# EAGLE design BatteryMQTTSense (EAGLE 9.2.2)
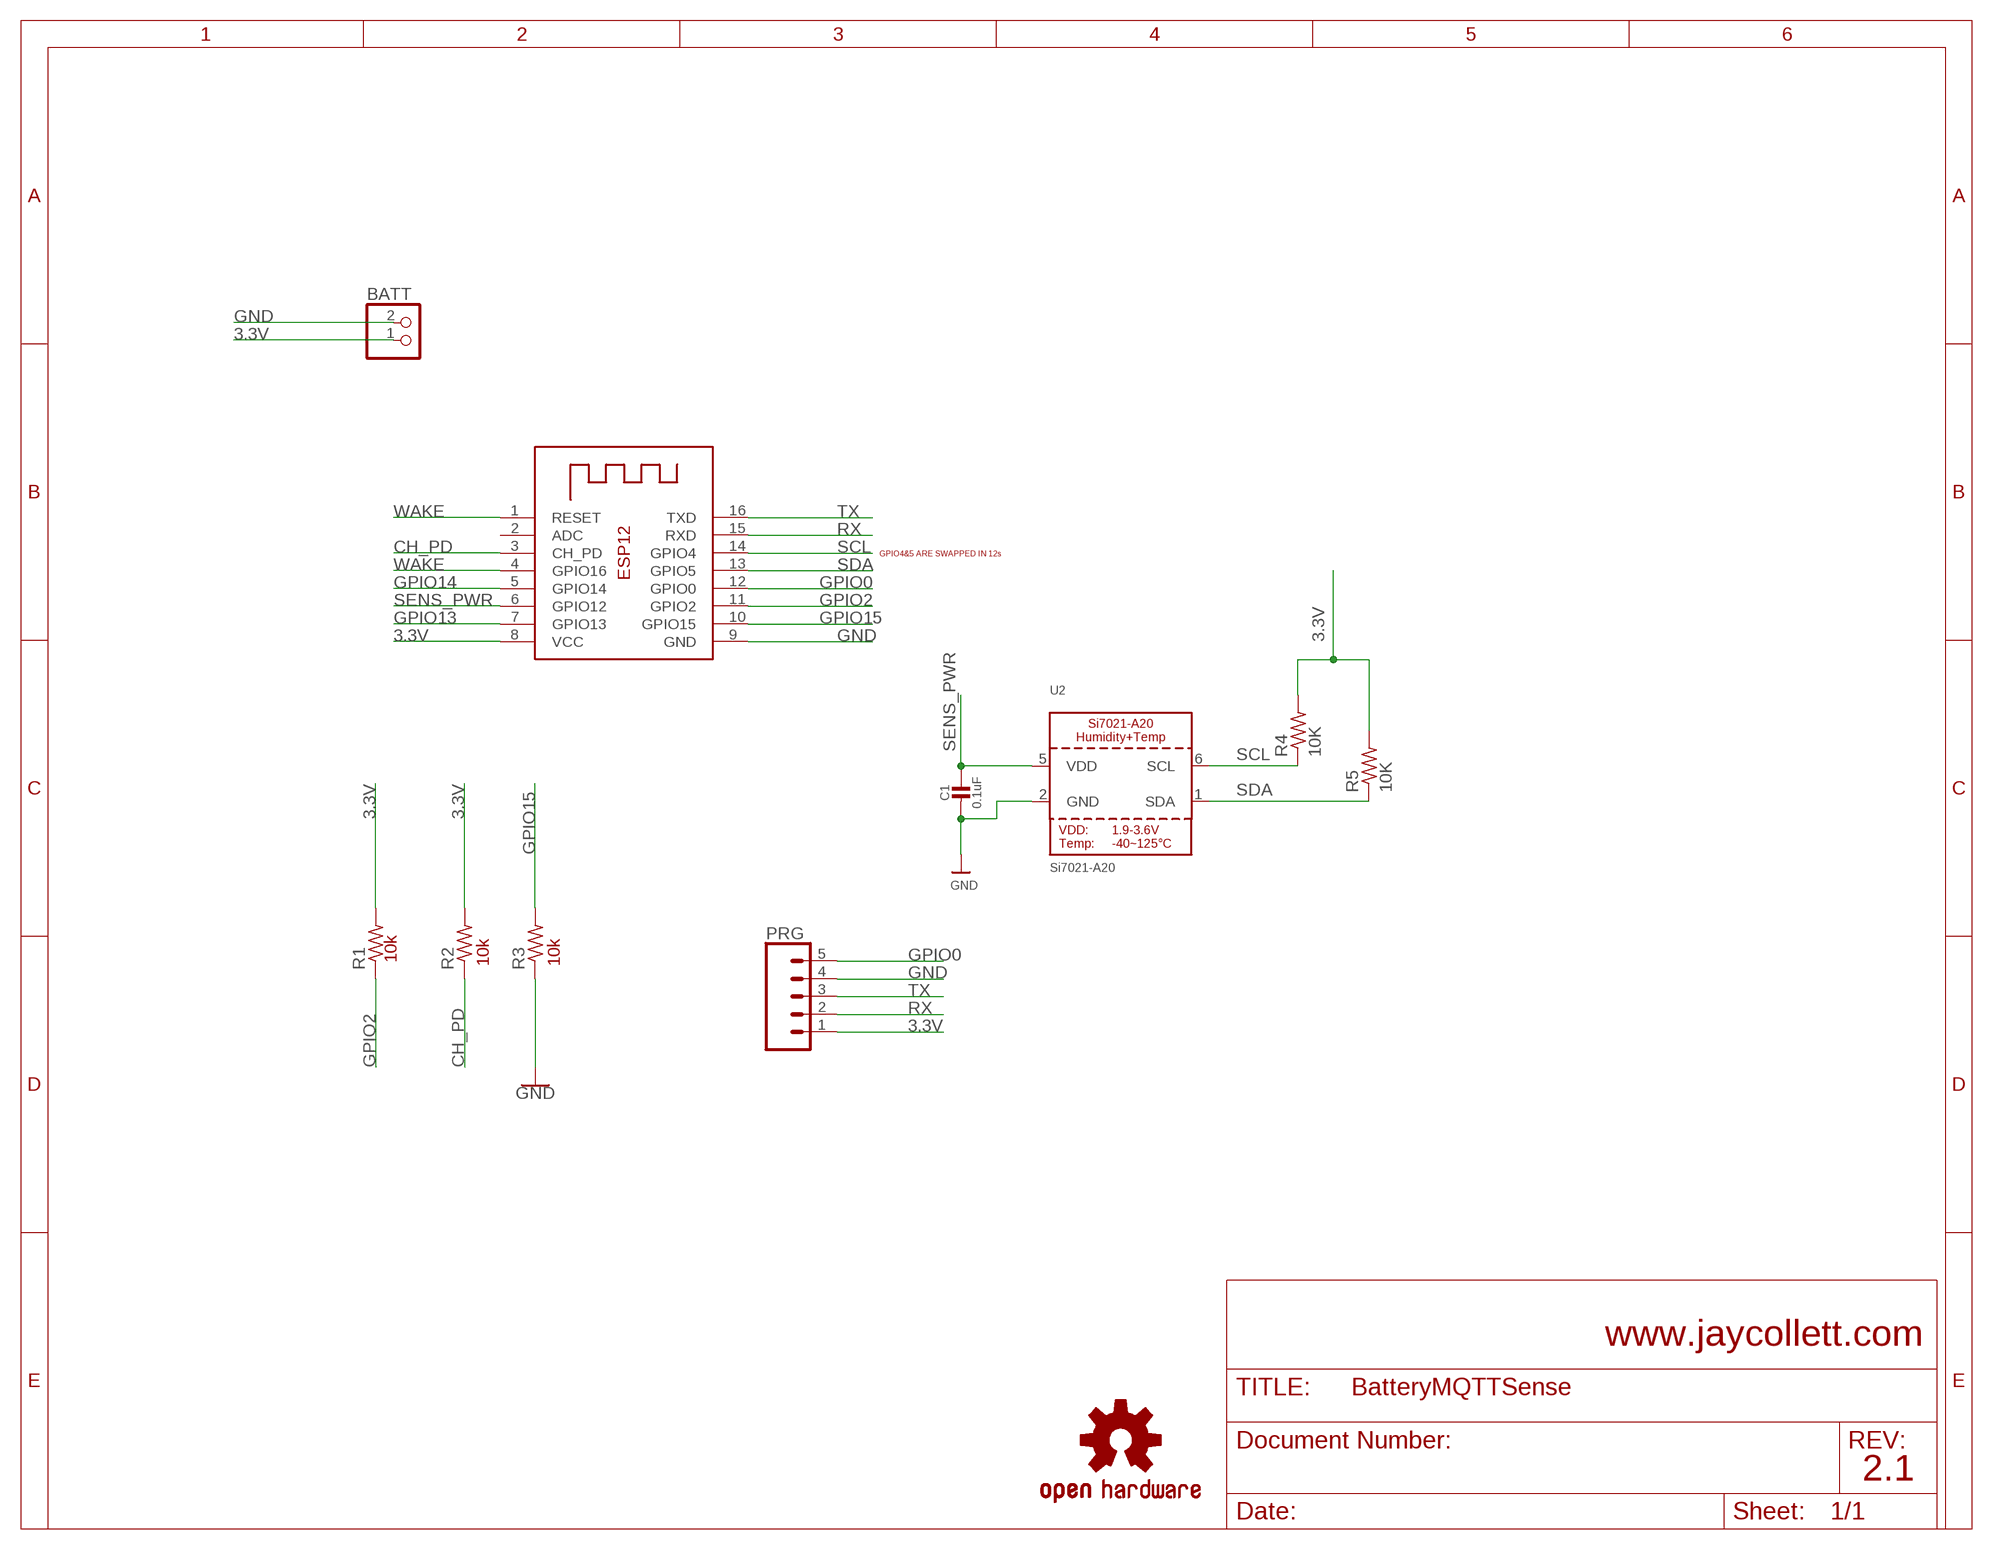
[diagram p0: schematic, sheet 1]

## Parts
_  ESP-12  [ESP-12]
BATT  JST_2PIN-THM-RA  [JST-PH-2-THM-RA]
C1  0.1uF  CAP_CERAMIC0805-NOOUTLINE  [0805-NO]
LOGO1  OSHW-LOGOS  [OSHW-LOGO-S]
PRG  CONN_05PTH_LONGPADS  [1X05_LONGPADS]
R1  R-US_M0805  [M0805]
R2  R-US_M0805  [M0805]
R3  R-US_M0805  [M0805]
R4  10K  R-US_M0805  [M0805]
R5  10K  R-US_M0805  [M0805]
U2  Si7021-A20  SI7021-A20  [DFN6_3X3_SI]

## Nets
3.3V [3.3V]: _.8(VCC) BATT.1 PRG.1 R1.2 R2.2 R4.2 R5.2
CH_PD: _.3(CH_PD) R2.1
GND: _.9(GND) BATT.2 C1.2 PRG.4 R3.1 U2.2(GND)
GPIO0: _.12(GPIO0) PRG.5
GPIO2: _.11(GPIO2) R1.1
GPIO13: _.7(GPIO13)
GPIO14: _.5(GPIO14)
GPIO15: _.10(GPIO15) R3.2
RX: _.15(RXD) PRG.2
SCL: _.14(GPIO4) R4.1 U2.6(SCL)
SDA: _.13(GPIO5) R5.1 U2.1(SDA)
SENS_PWR: _.6(GPIO12) C1.1 U2.5(VDD)
TX: _.16(TXD) PRG.3
WAKE: _.1(RESET) _.4(GPIO16)
Unconnected: _.2(ADC)

## Notes on the sheet
- GPIO4&5 ARE SWAPPED IN 12s
- 10k | 10k | 10k
- www.jaycollett.com
- 2.1

## Library data of the parts
_ = adafruit:ESP-12
BATT = adafruit:JST_2PIN: JST 2-Pin Connectors of various flavors SMT-RA (S2B-PH-SM4) 4UConnector #17311 SMT (B2B-PH-SM4) THM-RA (S2B-PH) THM (B2B-PH)
C1 = microbuilder:CAP_CERAMIC: Ceramic Capacitors For new designs, use the packages preceded by an '_' character since they are more reliable: The following footprints should be used on most boards: _0402 - Standard footprint for regular board layouts _0603 - Standard footprint for regular board layouts _0805 - Standard footprint for regular board layouts _1206 - Standard footprint for regular board layouts For extremely tight-pitch boards where space is at a premium, the following 'micro-pitch' footprints can be used (smaller pads, no silkscreen outline, etc.): _0402MP - Micro-pitch footprint for very dense/compact boards _0603MP - Micro-pitch footprint for very dense/compact boards _0805MP - Micro-pitch footprint for very dense/compact boards _1206MP - Micro-pitch footprint for very dense/compact boards
LOGO1 = SparkFun-Aesthetics:OSHW-LOGO: Open-Source Hardware (OSHW) Logo This logo indicates the piece of hardware it is found on incorporates a OSHW license and/or adheres to the definition of open source hardware found here: http://freedomdefined.org/OSHW
PRG = SparkFun-Connectors:CONN_05: Multi connection point. Often used as Generic Header-pin footprint for 0.1 inch spaced/style header connections On any of the 0.1 inch spaced packages, you can populate with these: Break Away Headers - Straight <https://www.sparkfun.com/products/116> (PRT-00116) Break Away Male Headers - Right Angle <https://www.sparkfun.com/products/553> (PRT-00553) Female Headers <https://www.sparkfun.com/products/115> (PRT-00115) Break Away Headers - Machine Pin <https://www.sparkfun.com/products/117> (PRT-00117) Break Away Female Headers - Swiss Machine Pin <https://www.sparkfun.com/products/743> (PRT-00743) For SCREWTERMINALS and SPRING TERMINALS visit here: Screw Terimnals on SparkFun.com <https://www.sparkfun.com/search/results?term=Screw+Terminals> (5mm/3.5mm/2.54mm spacing) This device is also useful as a general connection point to wire up your design to another part of your project. Our various solder wires solder well into these plated through hole pads. Hook-Up Wire - Assortment (Stranded, 22 AWG) <https://www.sparkfun.com/products/11375> (PRT-11375) Hook-Up Wire - Assortment (Solid Core, 22 AWG) <https://www.sparkfun.com/products/11367> (PRT-11367) View the entire wire category on our website here <https://www.sparkfun.com/categories/141> Special notes: Molex polarized connector foot print use with SKU : PRT-08231 with associated crimp pins and housings. 1MM SMD Version SKU: PRT-10208
R1-R5 = adafruit:R-US_: RESISTOR, American symbol
U2 = microbuilder:SI7021-A20: Si7021-A20 - I2C Humidity and Temperature Sensor VDD: 1.9-3.6V Operating Temperature: -40~125°C +/-3% RH (max) 0..80% RH Humidity Sensor +/-0.4°C (max-, -10~85°C Temperature Sensor 150uA Active, 60nA Standby

## Net classes
1 3.3V: width 0.305 mm, clearance 0.203 mm to class 0

## Board
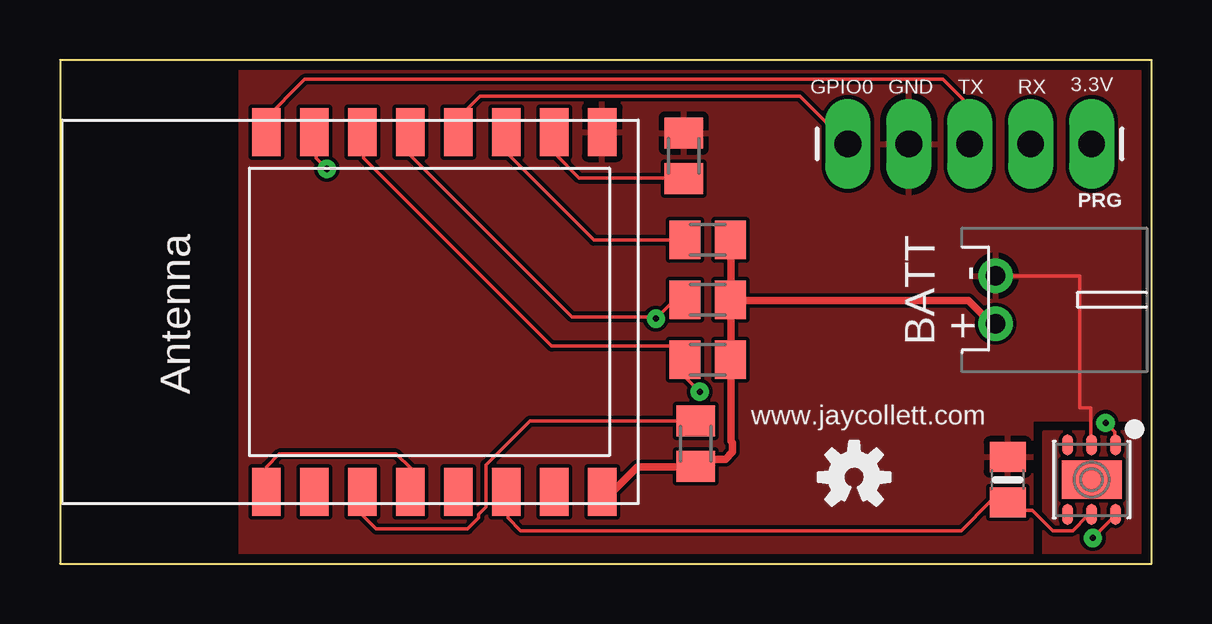
[diagram p1: board, top side]
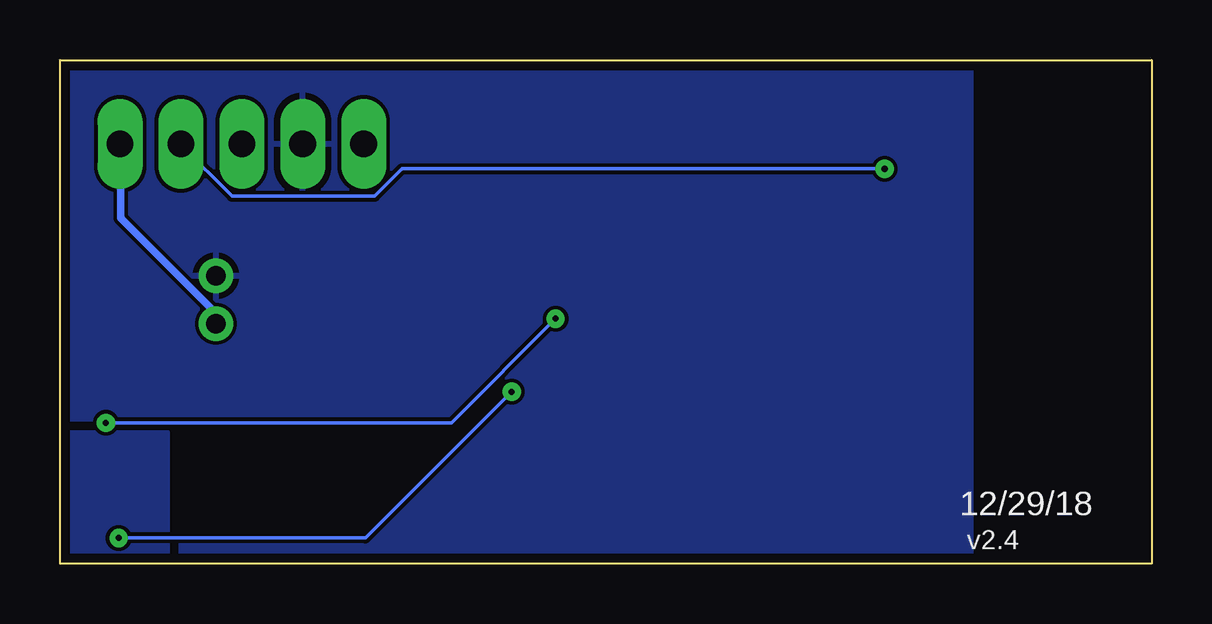
[diagram p2: board, bottom side, seen from below]

Size 45.5 x 21 mm. Coordinates in mm from the lower left corner, seen from the top.
Outline: 0,0 45.5,0 45.5,21 0,21 0,0
Copper layers (1*16): Top 0.035559375mm / dielectric 1.6mm / Bottom 0.035559375mm
Design rules "oshpark-2layer *": minimum track width 6mil, minimum drill 10mil, track to track 6mil, track to pad 6mil, pad to pad 6mil, via to via 6mil, smd to smd 6mil, copper to edge 15mil, drill to drill 6mil, minimum pad ring 12mil, minimum via ring 10mil, stop-mask expansion 4mil, vias tented up to drill 15mil, thermal gap 10mil

### Footprints (pad centres in the part's own frame; a part is rotated, then mirrored left to right if it is on the bottom)
ESP-12 = smd 2 x 1.2: 1 -7.5,4.5; 2 -7.5,2.5; 3 -7.5,0.5; 4 -7.5,-1.5; 5 -7.5,-3.5; 6 -7.5,-5.5; 7 -7.5,-7.5; 8 -7.5,-9.5; 9 7.5,-9.5; 10 7.5,-7.5; 11 7.5,-5.5; 12 7.5,-3.5; 13 7.5,-1.5; 14 7.5,0.5; 15 7.5,2.5; 16 7.5,4.5
JST-PH-2-THM-RA = drill 0.8 pad 1.422: 1 1,0; 2 -1,0
0805-NO = smd 1.24 x 1.5: 1 -0.95,0; 2 0.95,0
1X05_LONGPADS = drill 1.118 pad 1.88 long: 1 0,0; 2 2.54,0; 3 5.08,0; 4 7.62,0; 5 10.16,0
M0805 = smd 1.3 x 1.6: 1 -0.95,0; 2 0.95,0
DFN6_3X3_SI = smd 0.85 x 0.45: 1 -1.45,1; 2 -1.45,0; 3 -1.45,-1; 4 1.45,-1; 5 1.45,0; 6 1.45,1 | smd 1.6 x 2.5: P$1 0,0

### Placement (x,y rotation side)
_  13.1,10.5 90 top
BATT  39,11 270 top
C1  39.5,3.5 90 top
LOGO1  33.1,3.6 0 top
PRG  43,17.5 180 top
R1  27,13.5 0 top
R2  26.5,5 270 top
R3  26,17 270 top
R4  27,8.5 0 top
R5  27,11 0 top
U2  43,3.5 270 top

### Tracks (layer width: path | path; a pad name or v marks a point on that pad's centre or on a via)
3.3V
  Top 0.305: R5.2 27.96,10.97 27.96,8.53 R4.2 27.96,8.38 27.96,5.11 28.04,5.03 28.04,4.65 27.74,4.34 26.82,4.34 26.59,4.12 R2.2 26.44,4.04 24.08,4.04 23.09,3.05 22.63,3.05 _.8 | R1.2 27.96,13.49 27.96,11.12 R5.2 | R5.2 28.12,10.97 37.87,10.97 38.79,10.06 38.94,10.06 BATT.1
  Bottom 0.305: BATT.1 39.01,10.06 39.01,10.44 42.98,14.4 42.98,17.45 PRG.1
CH_PD
  Top 0.152: R2.1 26.44,5.94 19.58,5.94 17.75,4.12 17.75,2.36 17.45,2.06 17.45,1.91 16.99,1.45 13.18,1.45 12.57,2.06 12.57,2.97 _.3
GND
  Top 0.152: U2.2 42.98,4.95 42.98,6.5 42.5,6.5 42.5,12 BATT.2
  pour Top: 7.5,21 7.5,0 40.5,0 40.5,6 45.5,6 45.5,21
  pour Bottom (isolate 0.016): 7.5,21 7.5,0 40.5,0 40.5,6 45.5,6 45.5,21
GPIO0
  Top 0.152: PRG.5 30.84,19.5 17.5,19.5 16.5,18.5 16.6,18.4 _.12
GPIO2
  Top 0.152: R1.1 25.98,13.49 22.25,13.49 18.67,17.07 18.67,17.98 _.11
GPIO15
  Top 0.152: R3.2 25.98,16.08 21.64,16.08 20.65,17.07 20.65,17.98 _.10
ISO
  pour Top: 41,0 41,5.5 45.5,5.5 45.5,0
  pour Bottom: 41,0 41,5.5 45.5,5.5 45.5,0
RX  (via drill 0.25)
  Top 0.152: v11.12,16.46 10.67,16.92 10.67,17.98 _.15
  Bottom 0.152: v11.12,16.46 31.24,16.46 32.38,15.32 38.33,15.32 40.46,17.45 PRG.2
SCL  (via drill 0.25)
  Top 0.152: v43.05,1.07 43.97,1.98 U2.6 | v26.67,7.16 26.06,7.77 26.06,8.46 R4.1 25.98,8.53 25.45,9.07 20.5,9.07 12.65,16.92 12.65,17.98 _.14
  Bottom 0.152: v43.05,1.07 32.77,1.07 v26.67,7.16
SDA  (via drill 0.25)
  Top 0.152: v43.59,5.87 43.97,5.49 43.97,4.95 U2.1 | R5.1 25.98,10.97 25.6,10.97 v24.84,10.21 24.84,10.29 21.34,10.29 14.63,16.99 14.63,17.98 _.13
  Bottom 0.152: v43.59,5.87 29.18,5.87 v24.84,10.21
SENS_PWR
  Top 0.152: U2.5 42.98,1.98 42.82,1.98 42.22,1.37 41.38,1.37 40.54,2.21 39.85,2.21 39.55,2.52 C1.1 39.47,2.59 38.79,2.59 37.57,1.37 19.2,1.37 18.67,1.91 18.67,2.97 _.6
TX
  Top 0.152: PRG.3 37.92,19.08 36.81,20.19 10.19,20.19 8.5,18.5 8.6,18.4 _.16
WAKE
  Top 0.152: _.1 8.61,3.05 8.61,4.04 9.14,4.57 14.02,4.57 14.63,3.96 14.63,3.05 _.4

### Text on the board
tPlace: GPIO0 | GND | TX | RX | 3.3V | www.jaycollett.com
bPlace: 12/29/18 | v2.4